# EAGLE design H1FR20 (EAGLE 9.6.2)

## Sheet 1 of 2
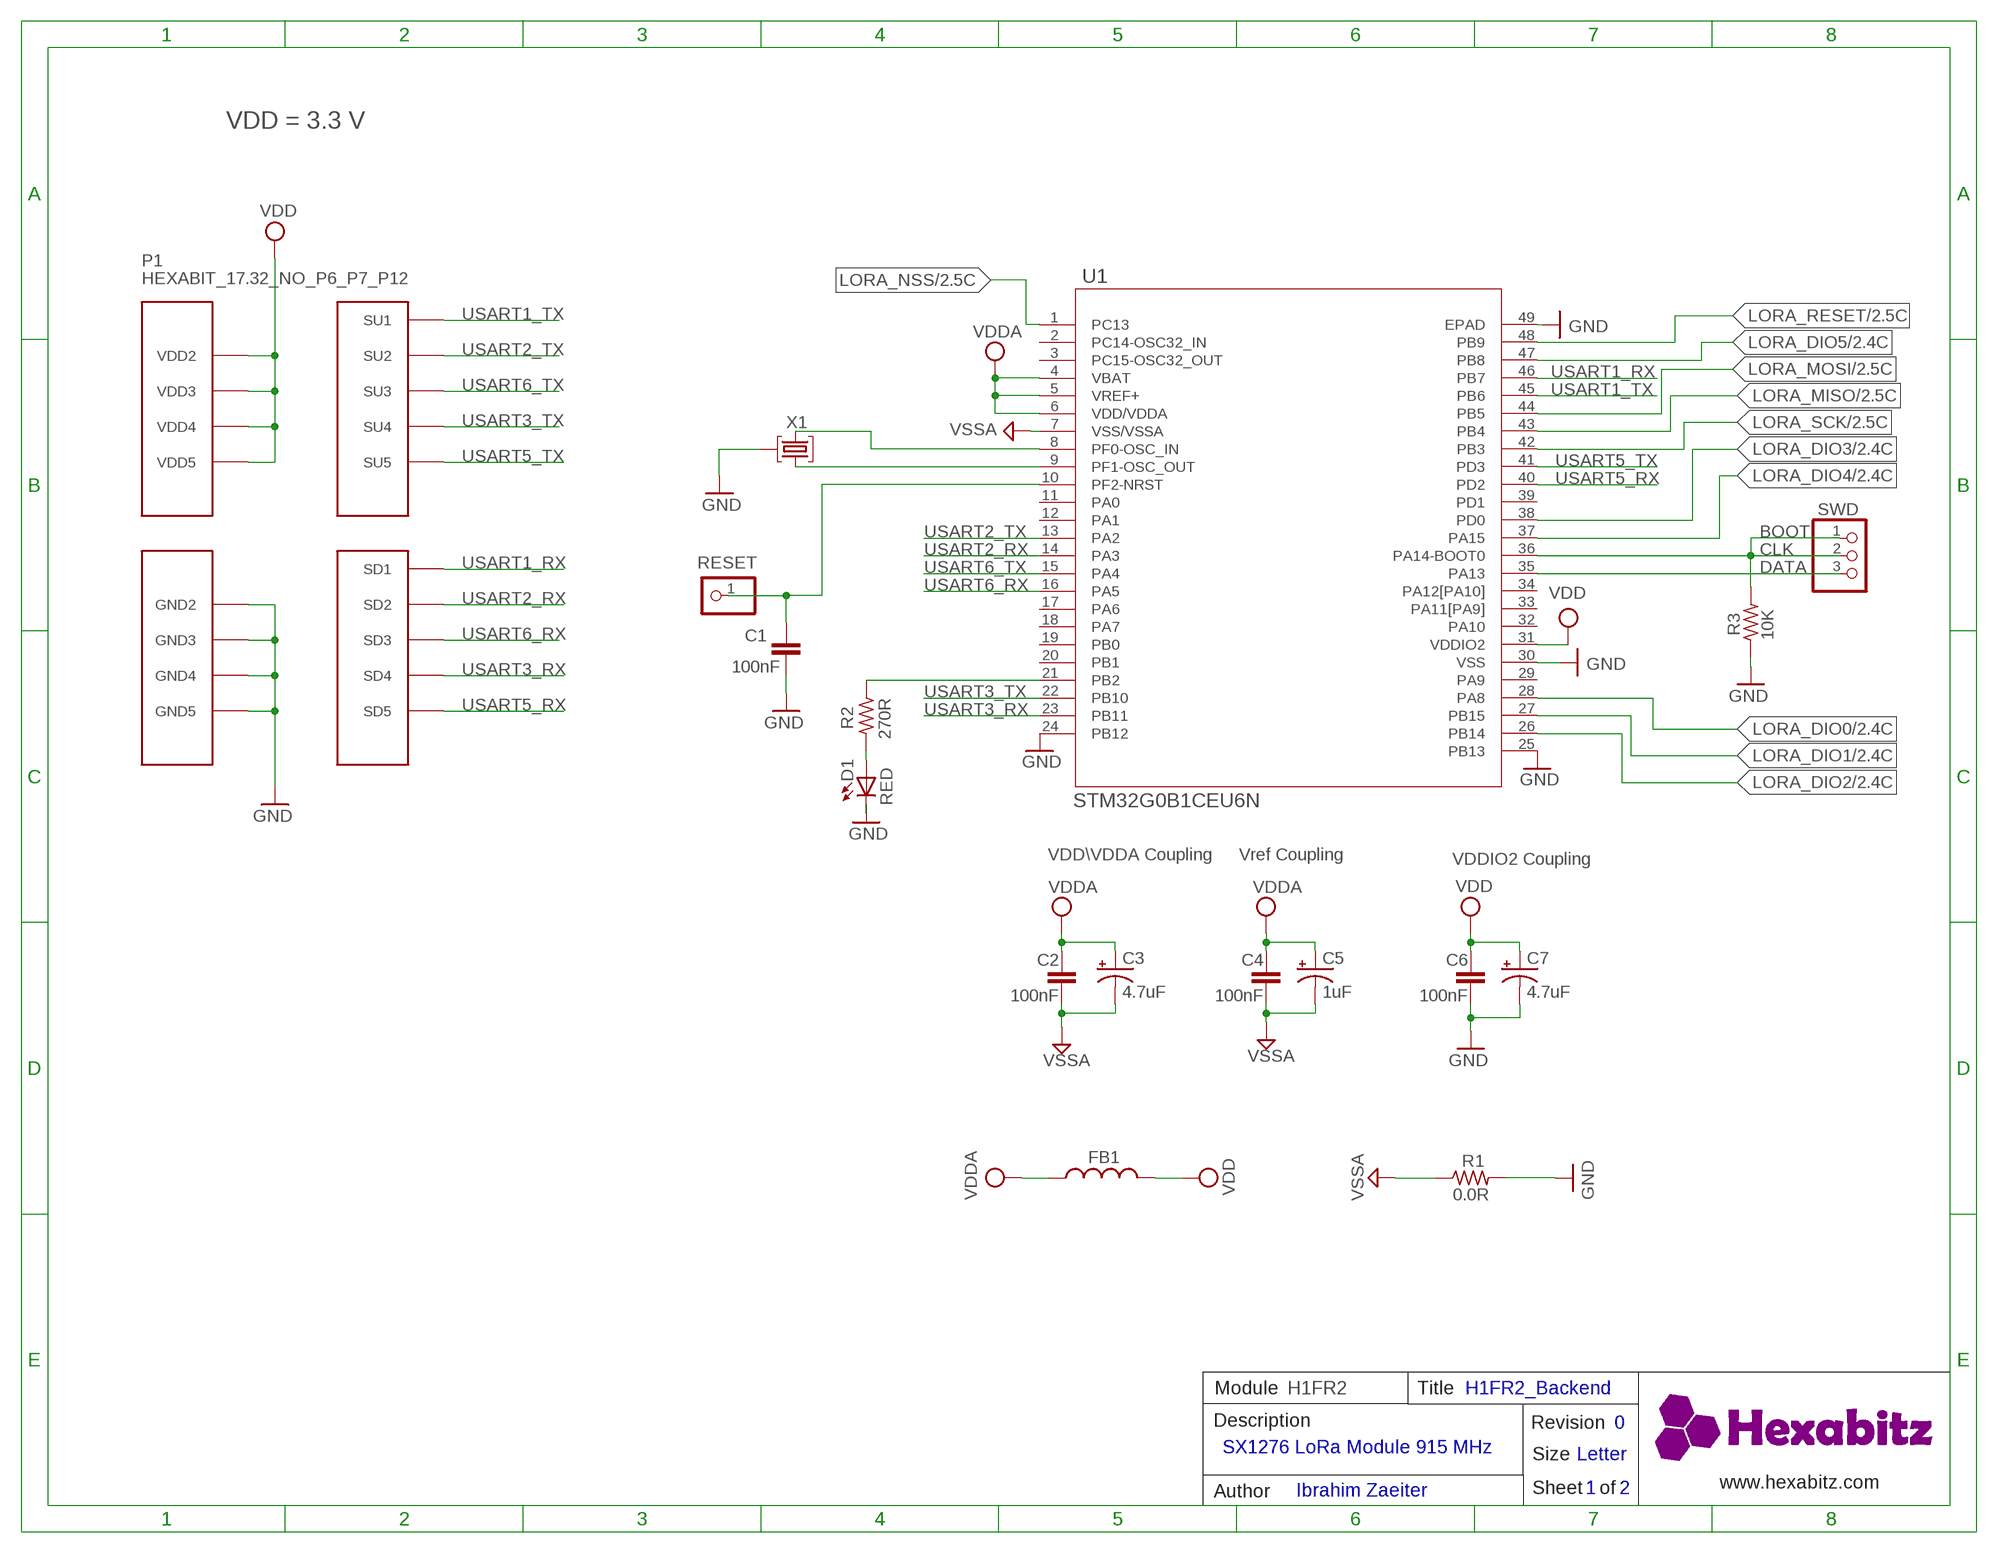
[diagram p0: schematic, sheet 1]

### Parts
C1  100nF  C-0603  [C-0603]
C2  100nF  C-0603  [C-0603]
C3  4.7uF  C-0805-POL  [C-0805-POL]
C4  100nF  C-0603  [C-0603]
C5  1uF  C-0805-POL  [C-0805-POL]
C6  100nF  C-0603  [C-0603]
C7  4.7uF  C-0805-POL  [C-0805-POL]
D1  RED  VLMS1300-GS08  [VLMS1300-GS08]
FB1  FB-0603  [FB-0603]
P1  HEXABIT_17.32_NO_P6_P7_P12  [HEXABIT_17.32_NO_P6_P7_P12]
R1  0.0R  R-0603  [R-0603]
R2  270R  R-0603  [R-0603]
R3  10K  R-0603  [R-0603]
RESET  R  PINHD-1X1  [1X01]
SWD  PINHD-1X3SWD  [SWD]
U1  STM32G0B1CEU6N  [HEXABITZ_ICS_QFN_B1CEU6_STM-L]
X1  XTALL_CSTCE8M00G52  [XTALL_CSTCE8M00G52]

### Nets
CLK: R3.2 SWD.1 SWD.2 U1.36(PA14-BOOT0)
DATA: SWD.3 U1.35(PA13)
GND: C1.2 C6.2 C7.2(-) D1.C P1.PAD_PD8(GND2) P1.PAD_PD9(GND3) P1.PAD_PD10(GND4) P1.PAD_PD11(GND5) R1.2 R3.1 U1.24(PB12) U1.25(PB13) U1.30(VSS) U1.49(EPAD) X1.P$2 ; also sheet 2
LORA_DIO0: U1.28(PA8) ; also sheet 2
LORA_DIO1: U1.27(PB15) ; also sheet 2
LORA_DIO2: U1.26(PB14) ; also sheet 2
LORA_DIO3: U1.38(PD0) ; also sheet 2
LORA_DIO4: U1.37(PA15) ; also sheet 2
LORA_DIO5: U1.47(PB8) ; also sheet 2
LORA_MISO: U1.43(PB4) ; also sheet 2
LORA_MOSI: U1.44(PB5) ; also sheet 2
LORA_NSS: U1.1(PC13) ; also sheet 2
LORA_RESET: U1.48(PB9) ; also sheet 2
LORA_SCK: U1.42(PB3) ; also sheet 2
N$1: D1.A R2.2
N$4: R2.1 U1.21(PB2)
N$5: U1.9(PF1-OSC_OUT) X1.P$1
N$6: U1.8(PF0-OSC_IN) X1.P$3
N$8: C1.1 RESET.1 U1.10(PF2-NRST)
USART1_RX: P1.PAD_PD1(SD1) U1.46(PB7)
USART1_TX: P1.PAD_PU1(SU1) U1.45(PB6)
USART2_RX: P1.PAD_PD2(SD2) U1.14(PA3)
USART2_TX: P1.PAD_PU2(SU2) U1.13(PA2)
USART3_RX: P1.PAD_PD4(SD4) U1.23(PB11)
USART3_TX: P1.PAD_PU4(SU4) U1.22(PB10)
USART5_RX: P1.PAD_PD5(SD5) U1.40(PD2)
USART5_TX: P1.PAD_PU5(SU5) U1.41(PD3)
USART6_RX: P1.PAD_PD3(SD3) U1.16(PA5)
USART6_TX: P1.PAD_PU3(SU3) U1.15(PA4)
VDD: C6.1 C7.1(+) FB1.2 P1.PAD_PU8(VDD2) P1.PAD_PU9(VDD3) P1.PAD_PU10(VDD4) P1.PAD_PU11(VDD5) U1.31(VDDIO2) ; also sheet 2
VDDA: C2.1 C3.1(+) C4.1 C5.1(+) FB1.1 U1.4(VBAT) U1.5(VREF+) U1.6(VDD/VDDA)
VSSA: C2.2 C3.2(-) C4.2 C5.2(-) R1.1 U1.7(VSS/VSSA)
Unconnected: U1.2(PC14-OSC32_IN) U1.3(PC15-OSC32_OUT) U1.11(PA0) U1.12(PA1) U1.17(PA6) U1.18(PA7) U1.19(PB0) U1.20(PB1) U1.29(PA9) U1.32(PA10) U1.33(PA11[PA9]) U1.34(PA12[PA10]) U1.39(PD1)

### Notes on the sheet
- VDD = 3.3 V
- BOOT
- VDD\VDDA Coupling | Vref Coupling | VDDIO2 Coupling
- Module | H1FR2 | Title | H1FR2_Backend
- Description | Revision | 0
- SX1276 LoRa Module 915 MHz
- Size | Letter
- www.hexabitz.com
- Author | Ibrahim Zaeiter | Sheet   of | 1 | 2
- C:/Users/Admin/Desktop/logodraft.bmp

## Sheet 2 of 2
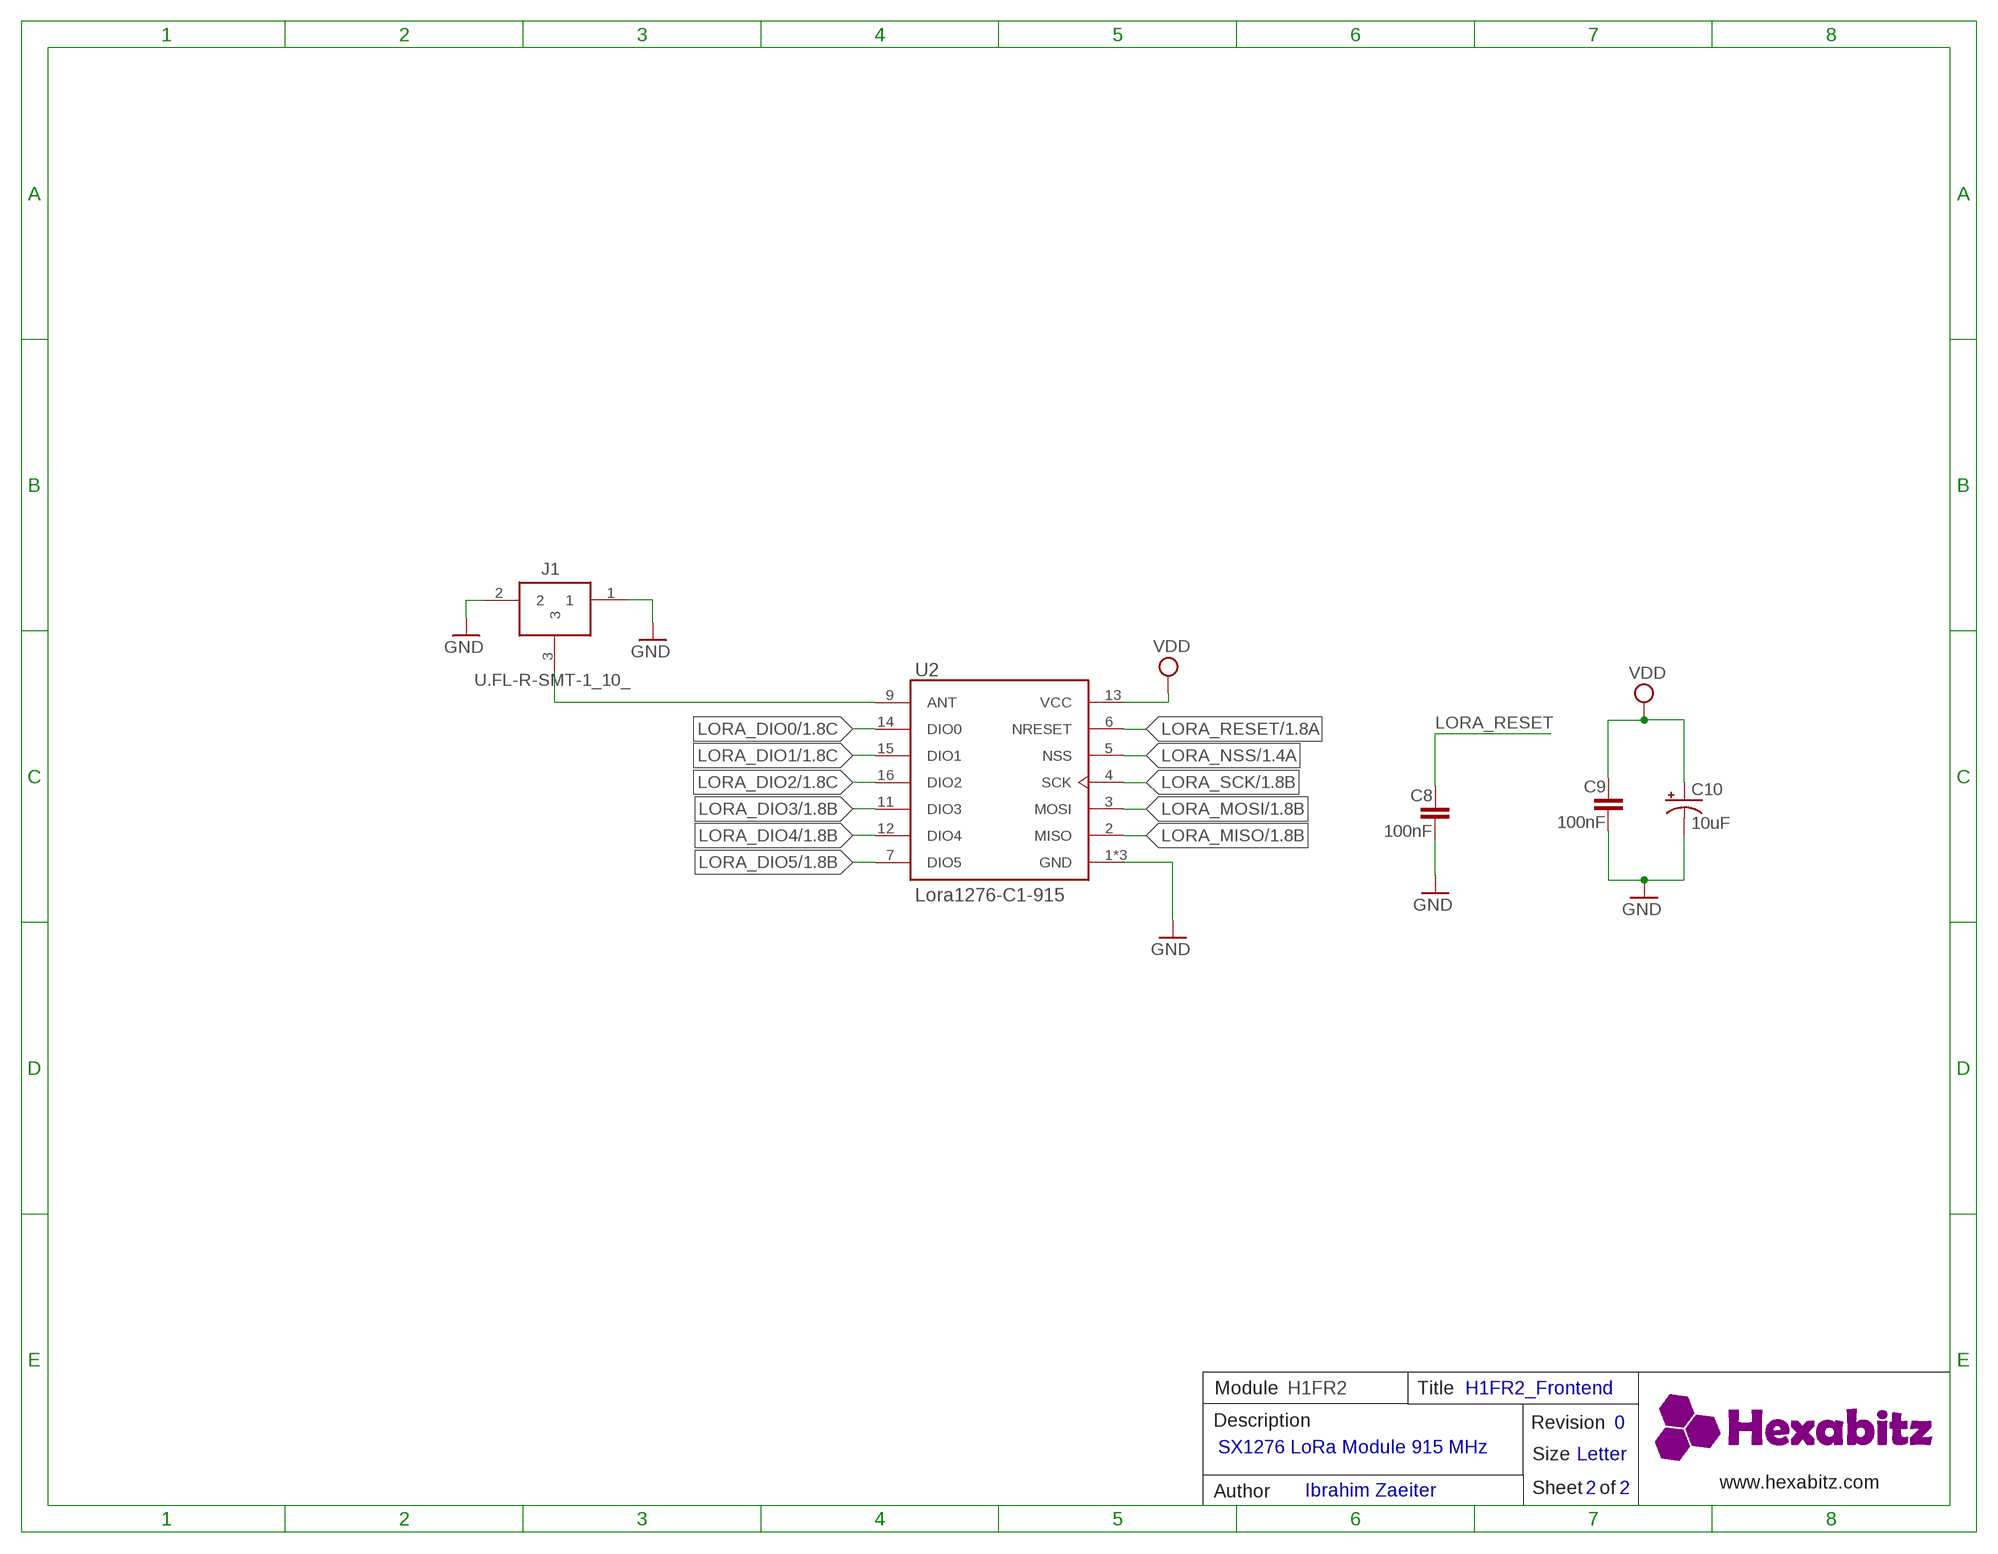
[diagram p1: schematic, sheet 2]

### Parts
C8  100nF  C-0603  [C-0603]
C9  100nF  C-0603  [C-0603]
C10  10uF  C-1210-POL  [C-1210-POL]
J1  U.FL-R-SMT-1_10_  [U.FL-R-SMT-1(10)]
U2  Lora1276-C1-915  LORA127X-C1  [LORA127X-C1]

### Nets
GND: C8.2 C9.2 C10.2(-) J1.1 J1.2 U2.1(GND) U2.8(GND) U2.10(GND) ; also sheet 1
LORA_DIO0: U2.14(DIO0) ; also sheet 1
LORA_DIO1: U2.15(DIO1) ; also sheet 1
LORA_DIO2: U2.16(DIO2) ; also sheet 1
LORA_DIO3: U2.11(DIO3) ; also sheet 1
LORA_DIO4: U2.12(DIO4) ; also sheet 1
LORA_DIO5: U2.7(DIO5) ; also sheet 1
LORA_MISO: U2.2(MISO) ; also sheet 1
LORA_MOSI: U2.3(MOSI) ; also sheet 1
LORA_NSS: U2.5(NSS) ; also sheet 1
LORA_RESET: C8.1 U2.6(NRESET) ; also sheet 1
LORA_SCK: U2.4(SCK) ; also sheet 1
N$2: J1.3 U2.9(ANT)
VDD: C9.1 C10.1(+) U2.13(VCC) ; also sheet 1

### Notes on the sheet
- Module | H1FR2 | Title | H1FR2_Frontend
- Description | Revision | 0
- SX1276 LoRa Module 915 MHz
- Size | Letter
- www.hexabitz.com
- Author | Ibrahim Zaeiter | Sheet   of | 2 | 2
- C:/Users/Admin/Desktop/logodraft.bmp

## Library data of the parts
C1 C2 C4 C6 C8 C9 = HEXABITZ_RCLS:C-0603: CAP CER 10% X7R 0603
C3 C5 C7 = HEXABITZ_RCLS:C-0805-POL: Cap Tant Solid SMD 2012
C10 = HEXABITZ_RCLS:C-1210-POL: Cap Tant Solid SMD 1210 Pol
D1 = Hexabitz:VLMS1300-GS08: Red 0603 130° Clear 54 mcd 2 V Surface Mount ChipLED ; Octopart Url : http://octopart.com/vlms1300-gs08-vishay-21709201; MFN: Vishay; MPN: VLMS1300-GS08; OCTOPART_URL: https://octopart.com/vlms1300-gs08-vishay-21709201?r=sp&s=_gcP4_q8T1SC6PJQPTQ9yA
FB1 = HEXABITZ_RCLS:FB-0603: Ferrite Beads Multi-Layer 0603
J1 = HEXABITZ_CONNECTION_PARTS:U.FL-R-SMT-1_10_: UFL SMT PCB receptable,DC-6GHz Hirose Straight 50 Surface Mount UFL Connector, Receptacle, Solder Termination Coaxial Source: Datasheet <https://www.hirose.com/product/document?clcode=CL0331-0472-2-10&productname=U.FL-R-SMT-1(10)&series=U.FL&documenttype=2DDrawing&lang=en&documentid=0000940684>; DESCRIPTION: UFL SMT PCB receptable,DC-6GHz Hirose Straight 50 Surface Mount UFL Connector, Receptacle, Solder Termination Coaxial; HEIGHT: mm; MANUFACTURER_NAME: Hirose; MANUFACTURER_PART_NUMBER: U.FL-R-SMT-1(10); MOUSER_PART_NUMBER: 798-U.FL-R-SMT-110; MOUSER_PRICE-STOCK: https://www.mouser.co.uk/ProductDetail/Hirose-Connector/U.FL-R-SMT-110?qs=kL1ClTr6oBoOdtqlGQpQrQ%3D%3D
P1 = hexabitz_connectors:HEXABIT_?_NO_P6_P7_P12: Hexabitz Hexagon Module Connector Hexagon side length = 17.32mm. The following ports are removed: P6 P7 P12
R1-R3 = HEXABITZ_RCLS:R-0603: Thick Film Resistors - SMD 0603
RESET = HEXABITZ_USER_INTERFACE_PARTS:PINHD-1X1: PIN HEADER; MFN: TE Connectivity; MPN: 87227-1; OCTOPART_URL: https://octopart.com/87227-1-te+connectivity-39512052?r=sp
SWD = HEXABITZ_CONNECTION_PARTS:PINHD-1X3: PIN HEADER
U1 = HEXABITZ_ICs:STM32G0B1CEU6N
U2 = HEXABITZ_ICs:LORA127X-C1: ESP-12E WiFi Module Check availability <https://pricing.snapeda.com/parts/ESP8266-12E/ESP-12E/AI-Thinker/view-part?ref=eda>; AVAILABILITY: Not in stock; CHECK_PRICES: https://www.snapeda.com/parts/ESP8266-12E/ESP-12E/AI-Thinker/view-part/?ref=eda; DESCRIPTION: This WiFi module has a 32-bit MCU micro and clock speeds supporting 80 MHz or 160 MHz. Supports the RTOS and integrated Wi-Fi MAC/BB/RF/PA/LNA, and has an on-board antenna.; MF: AI-Thinker; MP: ESP8266-12E/ESP-12E; PACKAGE: None; PRICE: None; SNAPEDA_LINK: https://www.snapeda.com/parts/ESP8266-12E/ESP-12E/AI-Thinker/view-part/?ref=snap
X1 = HEXABITZ_RCLS:XTALL_CSTCE8M00G52: MURATA CSTCE8M00G52-R0 RESONATOR, SMD, 8MHZ ; Octopart Url : https://octopart.com/cstce8m00g52-r0-murata-7145559; MFN: Murata; MPN: CSTCE8M00G52Z-R0; OCTOPART_URL: https://octopart.com/cstce8m00g52z-r0-murata-17755941?r=sp&s=JDnNJnrHQhyS8Zk4ofFWXw

## Board
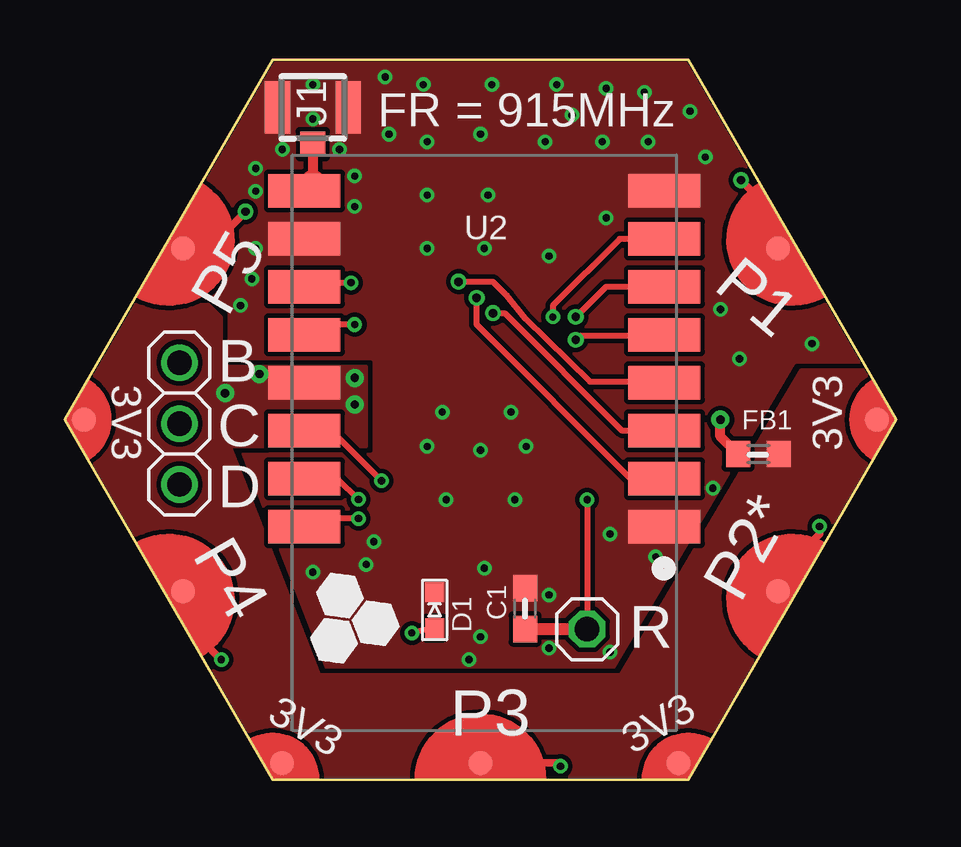
[diagram p2: board, top side]
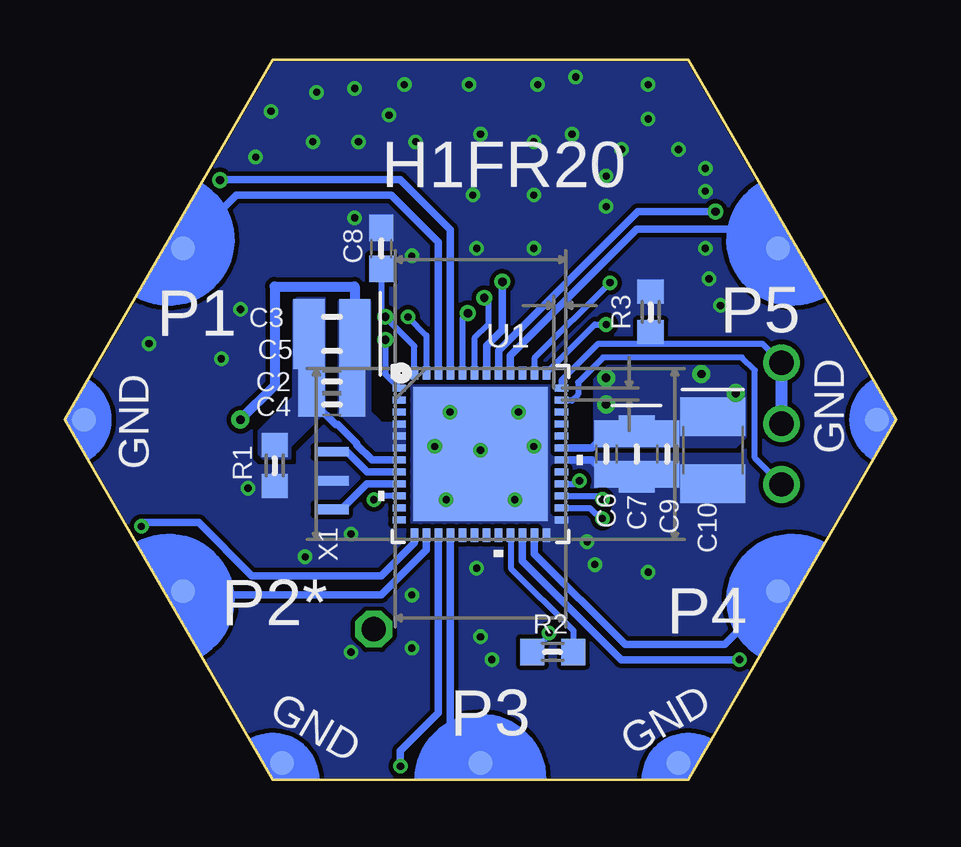
[diagram p3: board, bottom side, seen from below]

Size 34.64 x 30 mm. Coordinates in mm from the lower left corner, seen from the top.
Copper layers (1*16): Top 0.035mm / dielectric 1.5mm / Bottom 0.035mm
Design rules "default *": minimum track width 6mil, minimum drill 0.3mm, track to track 7.5mil, track to pad 7.5mil, pad to pad 7.5mil, via to via 7.5mil, smd to smd 0mil, copper to edge 1mil, drill to drill 6mil, minimum pad ring 10mil, minimum via ring 6mil, stop-mask expansion 4mil, vias tented up to drill 24mil, thermal gap 10mil

### Footprints (pad centres in the part's own frame; a part is rotated, then mirrored left to right if it is on the bottom)
C-0603 = smd 1.1 x 1: 1 -0.85,0; 2 0.85,0
C-0805-POL = smd 1.3 x 1.5: 1 -0.95,0; 2 0.95,0
C-1210-POL = smd 1.6 x 2.7: 1 -1.4,0; 2 1.4,0
VLMS1300-GS08 = smd 0.8 x 0.8: A 0,0.75; C 0,-0.75
FB-0603 = smd 1 x 1.1: 1 -0.85,0; 2 0.85,0
U.FL-R-SMT-1(10) = smd 1.05 x 2.2: 1 -1.475,0; 2 1.475,0 | smd 1.05 x 1.05: 3 0,1.525
HEXABIT_17.32_NO_P6_P7_P12 = smd 1 x 1 bottom: PAD_PD1 12.39,7.15; PAD_PD2 12.39,-7.15; PAD_PD3 0,-14.31; PAD_PD4 -12.39,-7.15; PAD_PD5 -12.39,7.15; PAD_PD8 16.52,0; PAD_PD9 8.26,-14.31; PAD_PD10 -8.26,-14.31; PAD_PD11 -16.52,0 | smd 1 x 1: PAD_PU1 12.39,7.15; PAD_PU2 12.39,-7.15; PAD_PU3 0,-14.31; PAD_PU4 -12.39,-7.15; PAD_PU5 -12.39,7.15; PAD_PU8 16.52,0; PAD_PU9 8.26,-14.31; PAD_PU10 -8.26,-14.31; PAD_PU11 -16.52,0
R-0603 = smd 1 x 1.1: 1 -0.85,0; 2 0.85,0
1X01 = drill 1.016 octagon: 1 0,0
SWD = drill 1.016: 1 -2.54,0; 2 0,0; 3 2.54,0
HEXABITZ_ICS_QFN_B1CEU6_STM-L = smd 0.55 x 0.297: 1 -3.38,2.751; 2 -3.38,2.251; 3 -3.38,1.75; 4 -3.38,1.25; 5 -3.38,0.75; 6 -3.38,0.25; 7 -3.38,-0.25; 8 -3.38,-0.75; 9 -3.38,-1.25; 10 -3.38,-1.75; 11 -3.38,-2.251; 12 -3.38,-2.751; 25 3.38,-2.751; 26 3.38,-2.251; 27 3.38,-1.75; 28 3.38,-1.25; 29 3.38,-0.75; 30 3.38,-0.25; 31 3.38,0.25; 32 3.38,0.75; 33 3.38,1.25; 34 3.38,1.75; 35 3.38,2.251; 36 3.38,2.751 | smd 0.297 x 0.55: 13 -2.751,-3.38; 14 -2.251,-3.38; 15 -1.75,-3.38; 16 -1.25,-3.38; 17 -0.75,-3.38; 18 -0.25,-3.38; 19 0.25,-3.38; 20 0.75,-3.38; 21 1.25,-3.38; 22 1.75,-3.38; 23 2.251,-3.38; 24 2.751,-3.38; 37 2.751,3.38; 38 2.251,3.38; 39 1.75,3.38; 40 1.25,3.38; 41 0.75,3.38; 42 0.25,3.38; 43 -0.25,3.38; 44 -0.75,3.38; 45 -1.25,3.38; 46 -1.75,3.38; 47 -2.251,3.38; 48 -2.751,3.38 | smd 5.6 x 5.6: 49 0,0
LORA127X-C1 = smd 3 x 1.4: 1 -7.5,7; 2 -7.5,5; 3 -7.5,3; 4 -7.5,1; 5 -7.5,-1; 6 -7.5,-3; 7 -7.5,-5; 8 -7.5,-7; 9 7.5,-7; 10 7.5,-5; 11 7.5,-3; 12 7.5,-1; 13 7.5,1; 14 7.5,3; 15 7.5,5; 16 7.5,7
XTALL_CSTCE8M00G52 = smd 1.4 x 0.4: P$1 0,1.2; P$2 0,0; P$3 0,-1.2

### Placement (x,y rotation side)
C1  19.18,7.13 90 top
C2  23.51,16.59 180 bottom
C3  23.51,19.29 180 bottom
C4  23.51,15.63 180 bottom
C5  23.51,17.86 180 bottom
C6  12.08,13.57 270 bottom
C7  10.81,13.57 270 bottom
C8  21.45,22.14 90 bottom
C9  9.54,13.57 270 bottom
C10  7.64,13.73 270 bottom
D1  15.42,7.06 180 top
FB1  28.91,13.57 0 top
J1  10.34,28.02 180 top
P1  17.32,15 0 top
R1  25.89,13.09 270 bottom
R2  14.3,5.32 180 bottom
R3  10.23,19.5 270 bottom
RESET  21.77,6.27 90 top
SWD  4.78,14.84 270 top
U1  17.32,13.57 0 bottom
U2  17.48,17.54 180 top
X1  23.51,12.46 180 bottom

### Tracks (layer width: path | path; a pad name or v marks a point on that pad's centre or on a via)
CLK
  Bottom 0.254: U1.36 13.94,16.65 12.42,18.17 10.34,18.17 | 10.34,18.17 5.57,18.17 SWD.1 | R3.2 10.34,18.55 10.34,18.17
  Bottom 0.508: SWD.1 SWD.2
DATA
  Bottom 0.254: SWD.3 5.89,13.41 5.89,17.06 6.42,17.6 12.21,17.6 13.25,16.56 13.25,16.05 13.51,15.79 13.91,15.79 U1.35
GND  (via drill 0.3 pad 0.55)
  Bottom 0.305: C6.2 12.68,13.32 U1.30
  other vias: 20.5,28.97 17.8,28.97 14.94,28.97 12.08,25.16 12.08,23.89 28.12,17.54 21.13,27.7 10.34,28.97 7.32,19.76 16.84,5 20.18,7.7 22.72,5.32 13.35,29.29 13.51,26.91 10.34,27.54 11.45,26.27 9.06,26.27 15.1,26.59 17.32,26.91 20.02,26.59 24.3,26.59 24.15,28.65 22.56,28.81 26.05,27.86 26.69,25.95 17.64,24.37 15.1,24.37 15.1,22.14 17.48,22.14 7.79,20.87 15.73,15.32 18.59,15.32 18.75,11.67 15.89,11.67 27.32,19.6 31.13,18.18 17.32,13.73 17.32,5.95 10.34,8.65 20.18,5.47 17.48,8.81 15.1,13.89 19.23,13.89 12.56,8.97 12.88,9.92 22.72,10.24 27,12.14 24.62,9.29 22.56,23.41 20.18,21.83 7.95,22.14 7.95,25.48 7.95,24.52 22.4,26.59
  pour Top (rank 3, no thermals): 8.59,29.92 25.89,29.92 34.62,15 25.89,0.08 8.75,0.08 0.02,15
  pour Bottom (rank 3, no thermals): 8.59,29.92 25.89,29.92 34.62,15 25.89,0.08 8.75,0.08 0.02,15
LORA_DIO0  (via drill 0.3 pad 0.55)
  Top 0.254: v13.19,12.46 11.13,14.52 10,14.52 U2.14
  Bottom 0.254: U1.28 13.33,12.32 v13.19,12.46
LORA_DIO1  (via drill 0.3 pad 0.55)
  Top 0.254: v12.24,11.68 11.38,12.54 U2.15
  Bottom 0.254: U1.27 12.38,11.82 v12.24,11.68
LORA_DIO2  (via drill 0.3 pad 0.55)
  Top 0.254: v12.24,10.88 10.32,10.88 U2.16
  Bottom 0.254: U1.26 12.76,11.32 12.5,11.06 12.41,11.06 v12.24,10.88
LORA_DIO3  (via drill 0.3 pad 0.55)
  Top 0.254: 10.15,20.71 v11.92,20.71
  Top 0.305: U2.11 10.15,20.71
  Bottom 0.254: v11.92,20.71 15.07,17.57 U1.38
LORA_DIO4  (via drill 0.3 pad 0.55)
  Top 0.254: v12.08,18.97 10.41,18.97 U2.12
  Bottom 0.254: U1.37 12.55,18.97 v12.08,18.97
LORA_DIO5  (via drill 0.3 pad 0.55)
  Top 0.254: U2.7 23.11,22.54 20.34,19.76 v20.34,19.29
  Bottom 0.254: v20.34,19.29 19.57,18.52 U1.47
LORA_MISO  (via drill 0.35)
  Top 0.254: U2.2 23.59,12.54 17.16,18.97 v17.16,20.08
  Bottom 0.254: v17.16,20.08 17,19.92 17,18.97 17.57,18.4 U1.43
LORA_MOSI  (via drill 0.35)
  Top 0.254: U2.3 23.23,14.54 18.32,19.44 v17.85,19.44
  Bottom 0.254: v17.85,19.44 18.07,19.22 U1.44
LORA_NSS  (via drill 0.35)
  Top 0.254: U2.5 24.93,18.49 21.45,18.49 v21.29,18.33
  Bottom 0.254: v21.29,18.33 21.29,16.91 U1.1
LORA_RESET  (via drill 0.35)
  Top 0.254: U2.6 22.54,20.54 v21.29,19.29
  Bottom 0.254: U1.48 20.07,18.07 v21.29,19.29 21.45,19.44 C8.1
LORA_SCK  (via drill 0.35)
  Top 0.254: v16.41,20.76 17.84,20.76 18.42,20.18 19.19,19.22 21.88,16.59 24.93,16.59 U2.4
  Bottom 0.305: v16.41,20.76 16.41,18.74 17.07,18.08 U1.42
N$1  (via drill 0.3 pad 0.55)
  Top 0.254: D1.A v14.46,6.11
  Bottom 0.254: v14.46,6.11 14.46,6.01 R2.2
N$2
  Top 0.406: J1.3 10.34,24.9
  Top 1.016: 10.34,24.9 U2.9
N$4
  Bottom 0.254: U1.21 16.05,10.17 16.05,8.81 13.45,6.21 R2.1
N$5
  Bottom 0.305: U1.9 22.06,12.32 23.12,11.26 X1.P$1
N$6
  Bottom 0.305: U1.8 22.04,12.83 22.87,13.66 X1.P$3
N$8  (via drill 0.3 pad 0.55)
  Top 0.254: v21.77,11.67 21.77,6.43 21.53,6.19 | 21.61,6.11 RESET.1
  Top 0.508: C1.1 21.61,6.28 21.53,6.19 21.61,6.11
  Bottom 0.254: U1.10 21.55,11.82 21.73,11.64 v21.77,11.67
USART1_RX
  Bottom 0.305: P1.PAD_PD1 27.49,24.37 21.04,24.37 19.07,22.4 U1.46
USART1_TX  (via drill 0.35)
  Top 0.305: v28.17,24.99 29.2,23.96 29.71,23.08 P1.PAD_PU1
  Bottom 0.305: U1.45 18.57,22.92 20.65,25 28.16,25 v28.17,24.99
USART2_RX
  Bottom 0.305: U1.14 19.57,9.57 21.45,7.69 29.55,7.69 P1.PAD_PD2
USART2_TX  (via drill 0.3 pad 0.55)
  Top 0.305: 29.07,8.49 P1.PAD_PU2 29.71,8.48 30.18,8.95 30.18,8.97 31.45,10.24 v31.45,10.55
  Bottom 0.305: v31.45,10.55 31.29,10.71 29.07,10.71 26.84,8.49 21.45,8.49 20.07,9.87 U1.13
USART3_RX
  Bottom 0.305: U1.23 15.07,9.42 11.29,5.63 7.15,5.63 P1.PAD_PD4
USART3_TX  (via drill 0.3 pad 0.55)
  Top 0.305: v6.53,5 5.73,5.79 5.73,7.05 P1.PAD_PU4
  Bottom 0.305: U1.22 15.57,9.12 11.45,5 v6.53,5
USART5_RX
  Bottom 0.305: P1.PAD_PD5 5.72,22.94 10.81,22.94 16.07,17.68 U1.40
USART5_TX  (via drill 0.35)
  Top 0.305: v7.53,23.68 6,22.15 P1.PAD_PU5
  Bottom 0.305: v7.53,23.68 10.77,23.68 16.57,17.88 U1.41
USART6_RX
  Bottom 0.305: P1.PAD_PD3 18.57,1.94 U1.16
USART6_TX  (via drill 0.3 pad 0.55)
  Top 0.305: v20.65,0.55 20.52,0.69 P1.PAD_PU3
  Bottom 0.305: U1.15 19.07,2.77 20.65,1.19 v20.65,0.55
VDD  (via drill 0.35 pad 0.75)
  Bottom 0.305: U1.31 12.68,13.82 C6.1
  other vias: 12.08,16.75 8.11,16.9 6.68,16.11 12.08,15.63
  pour Bottom (no thermals): 12.56,13.89 12.56,17.22 6.21,17.22 6.21,14.36 6.68,13.89
  pour Top (no thermals): 12.56,13.89 12.56,17.22 6.21,17.22 6.21,14.36 6.68,13.89
  pour Top (rank 2, no thermals): 5.97,19.83 2.74,19.79 1.92,18.97 0.11,15.35 0.07,15.06 6.89,2.31 8.59,-0.24 26.33,-0.24 34.54,15.11 34.24,16.61 33.69,17.06 30.68,17.06 23.16,4.36 10.6,4.36 6.53,14.83 6.53,19.28
VDDA  (via drill 0.35 pad 0.75)
  Top 0.406: FB1.1 27.32,14.31 v27.32,15
  Bottom 0.406: v27.32,15 25.89,16.43 25.89,20.56 22.56,20.56 C3.1
  pour Bottom (no thermals): 20.5,14.84 20.5,13.89 20.5,13.73 20.97,13.73 21.77,13.73 23.19,15.16 23.19,19.92 21.92,19.92 21.92,15.32 21.61,15 21.45,14.84
VSSA
  Bottom 0.305: U1.7 21.83,13.32 22.47,13.96 22.47,14 23.26,14.79 23.35,14.79 24.2,15.63 C4.2
  pour Bottom (no thermals): 23.83,20.08 23.83,15.16 24.94,15.16 25.1,15.32 25.1,19.92 24.94,20.08
  pour Bottom (no thermals): 23.83,15.32 25.26,13.89 25.26,13.41 26.37,13.41 26.53,13.57 26.53,14.52 25.1,15.95 23.83,15.95

### Text on the board
tPlace: FR = 915MHz | P1 | P5 | 3V3 | 3V3 | P4 | P2* | 3V3 | P3 | 3V3
bPlace: H1FR20 | P3
bNames: P5 | P1 | GND | GND | P4 | P2* | GND | GND